# EAGLE design base (EAGLE 9.1.3)
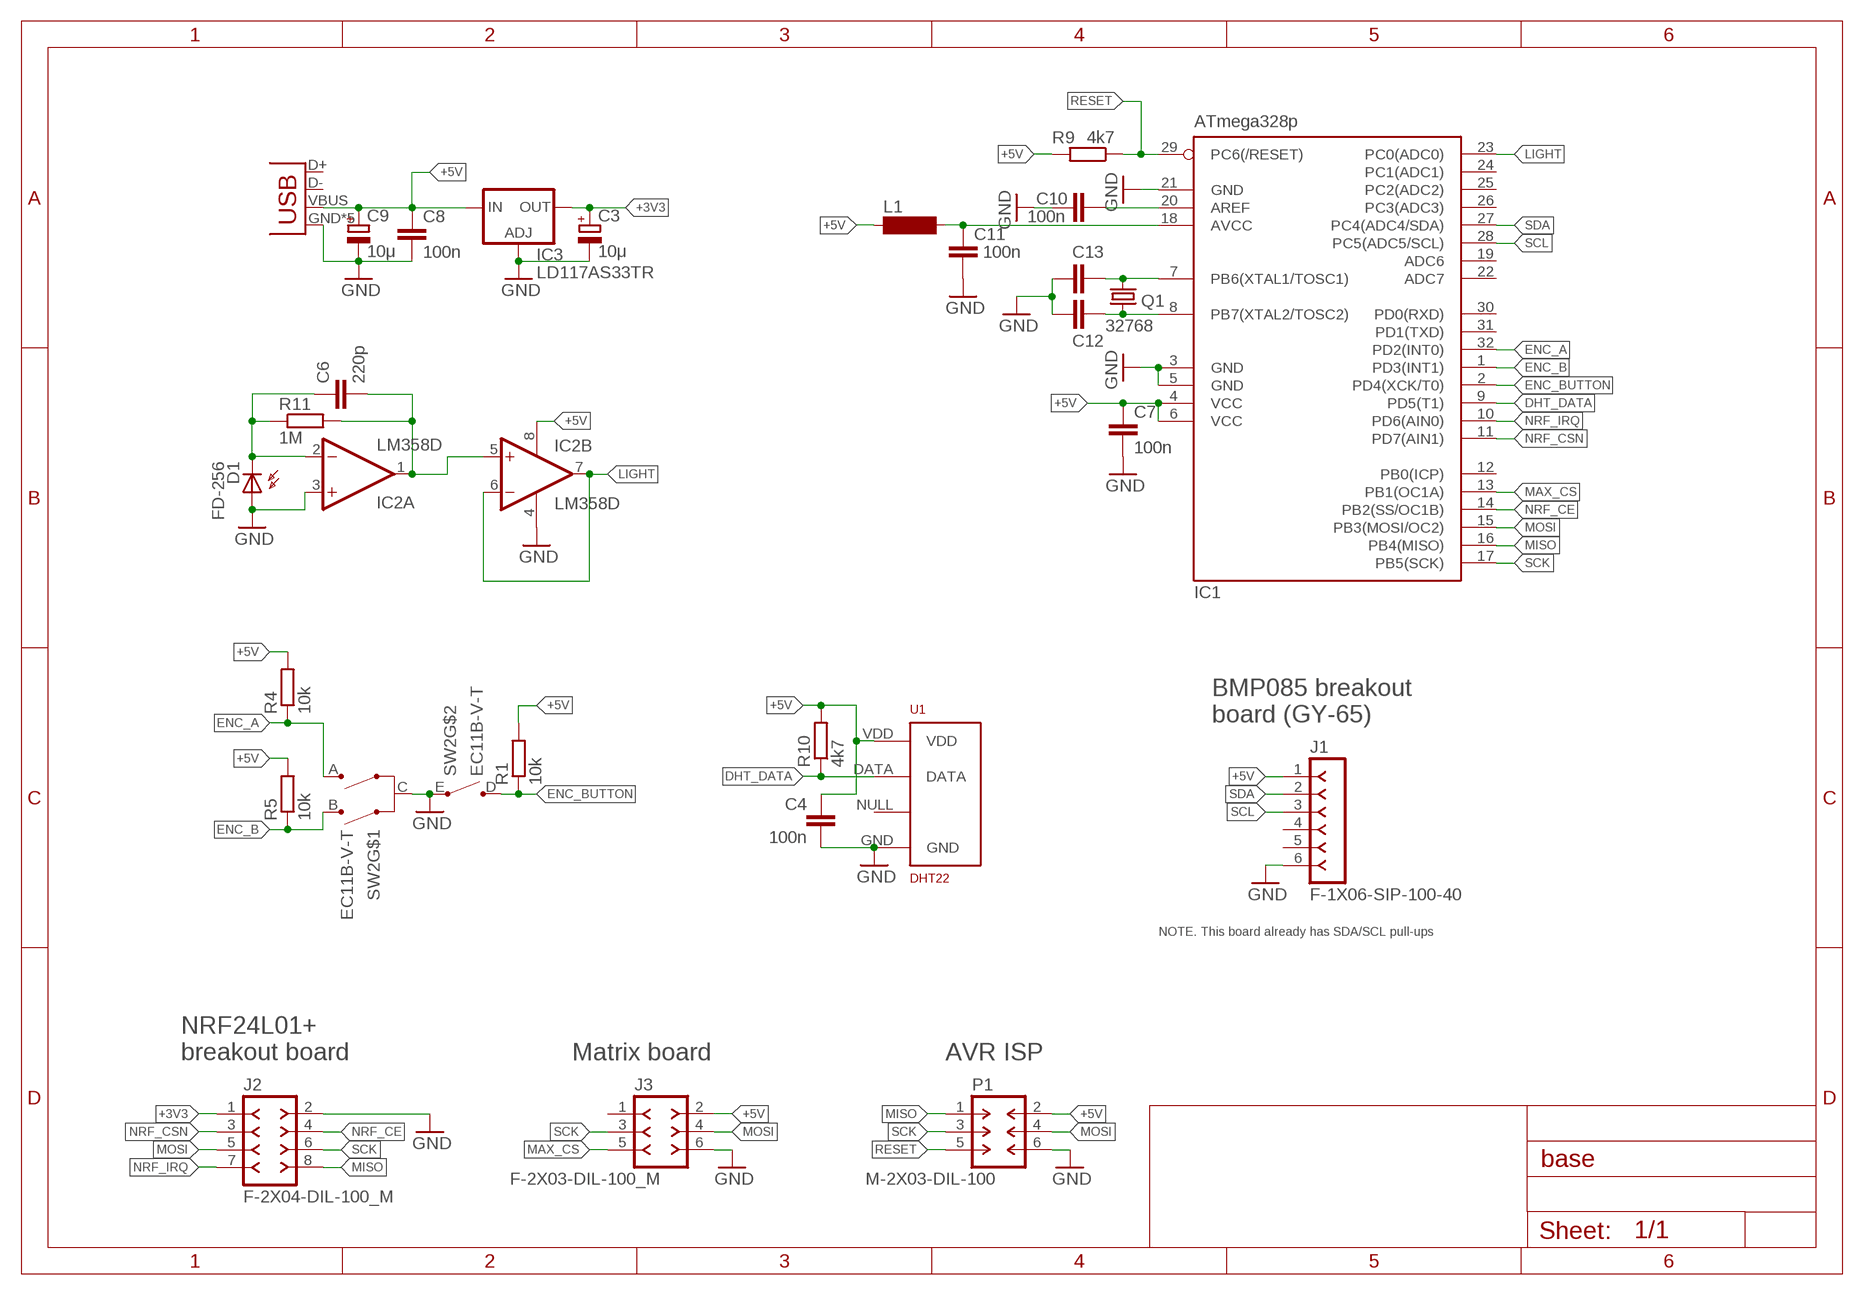
[diagram p0: schematic, sheet 1]

## Parts
C3  10μ  CPOL-EUD/7343-31R  [D/7343-31R]
C4  100n  C-EUC1206  [C1206]
C6  220p  C-EUC1206  [C1206]
C7  100n  C-EUC0805  [C0805]
C8  100n  C-EUC1206  [C1206]
C9  10μ  CPOL-EUD/7343-31R  [D/7343-31R]
C10  100n  C-EUC0805  [C0805]
C11  100n  C-EUC0805  [C0805]
C12  C-EUC0805  [C0805]
C13  C-EUC0805  [C0805]
D1  FD-256  BPX65  [BPX65]
IC1  ATmega328p  MEGA8-AI  [TQFP32-08]
IC2  LM358D  [SO08]
IC3  LD117AS33TR  [SOT223]
J1  F-1X06-SIP-100-40  [SIP-100-06-40]
J2  F-2X04-DIL-100_M  [DIL-100-2X04_M]
J3  F-2X03-DIL-100_M  [DIL-100-2X03_M]
JP5  USB-MICROB  [USB-MICROB]
L1  SM-1206  [SM-1206]
P1  M-2X03-DIL-100  [DIL-100-2X03]
Q1  32768  CRYSTALTC26H  [TC26H]
R1  10k  R-EU_R1206  [R1206]
R4  10k  R-EU_R1206  [R1206]
R5  10k  R-EU_R1206  [R1206]
R9  4k7  R-EU_R1206  [R1206]
R10  4k7  R-EU_R1206  [R1206]
R11  1M  R-EU_R1206  [R1206]
SW2  EC11B-V-T  [EC11B-V]
U1  DHT22  RHT03_DHT-22_AM2302RA  [RHT03_DHT-22/RA]

## Nets
+3V3: C3.+ IC3.4(OUT) J2.1
+5V: C4.1 C7.1 C8.1 C9.+ IC1.4(VCC) IC1.6(VCC) IC2.8(P:V+) IC3.3(IN) J1.1 J3.2 JP5.VBUS L1.1 P1.2 R1.2 R4.2 R5.2 R9.2 R10.2 U1.VDD
DHT_DATA: IC1.9(PD5(T1)) R10.1 U1.DATA
ENC_A: IC1.32(PD2(INT0)) R4.1 SW2.A
ENC_B: IC1.1(PD3(INT1)) R5.1 SW2.B
ENC_BUTTON: IC1.2(PD4(XCK/T0)) R1.1 SW2.D
GND: C3.- C4.2 C7.2 C8.2 C9.- C10.2 C11.2 C12.2 C13.2 D1.A IC1.3(GND) IC1.5(GND) IC1.21(GND) IC2.3(A:+IN) IC2.4(P:V-) IC3.1(ADJ) J1.6 J2.2 J3.6 JP5.GND JP5.MT1(GND) JP5.MT2(GND) JP5.P$1(GND) JP5.P$2(GND) P1.6 SW2.C SW2.E U1.GND
LIGHT: C6.2 IC1.23(PC0(ADC0)) IC2.1(A:OUT) IC2.5(B:+IN) IC2.6(B:-IN) IC2.7(B:OUT) R11.2
MAX_CS: IC1.13(PB1(OC1A)) J3.5
MISO: IC1.16(PB4(MISO)) J2.8 P1.1
MOSI: IC1.15(PB3(MOSI/OC2)) J2.5 J3.4 P1.4
N$33: C10.1 IC1.20(AREF)
N$34: C6.1 D1.K(C) IC2.2(A:-IN) R11.1
N$35: C11.1 IC1.18(AVCC) L1.2
N$36: C12.1 IC1.8(PB7(XTAL2/TOSC2)) Q1.1
N$37: C13.1 IC1.7(PB6(XTAL1/TOSC1)) Q1.2
NRF_CE: IC1.14(PB2(SS/OC1B)) J2.4
NRF_CSN: IC1.11(PD7(AIN1)) J2.3
NRF_IRQ: IC1.10(PD6(AIN0)) J2.7
RESET: IC1.29(PC6(/RESET)) P1.5 R9.1
SCK: IC1.17(PB5(SCK)) J2.6 J3.3 P1.3
SCL: IC1.28(PC5(ADC5/SCL)) J1.3
SDA: IC1.27(PC4(ADC4/SDA)) J1.2
Unconnected: IC1.12(PB0(ICP)) IC1.19(ADC6) IC1.22(ADC7) IC1.24(PC1(ADC1)) IC1.25(PC2(ADC2)) IC1.26(PC3(ADC3)) IC1.30(PD0(RXD)) IC1.31(PD1(TXD)) J1.4 J1.5 J3.1 JP5.D+ JP5.D- U1.NULL

## Notes on the sheet
- BMP085 breakout
  board (GY-65)
- NOTE. This board already has SDA/SCL pull-ups
- NRF24L01+
  breakout board
- Matrix board | AVR ISP

## Library data of the parts
C3 C9 = rcl:CPOL-EU: POLARIZED CAPACITOR, European symbol
C4 C6-C8 C10-C13 = rcl:C-EU: CAPACITOR, European symbol
D1 = opto-trans-siemens:BPX65: PHOTO DIODE; MPN: BPX65.; OC_FARNELL: 327451; OC_NEWARK: 06WX2764
IC1 = atmel:MEGA8: MICROCONTROLLER 8 Kbytes FLASH, 1 kbytes SRAM, 512 bytes EEPROM, USART, 6-channel 10 bit ADC, 2-channel 8 bit ADC Pin compatible with Atmega48, ATMega88, ATMega168 Source: avr.lbr; MPN: ATMEGA8-16AU; OC_FARNELL: 9171371; OC_NEWARK: 73M8863
IC2 = linear:LM358: OP AMP also LM158; LM258; LM2904 Source: http://cache.national.com/ds/LM/LM158.pdf
IC3 = v-reg:LD117A?*: Low drop fixed and adjustable positive voltage regulators 1 A Source: http://www.st.com/stonline/products/literature/ds/7194/ld1117axx.pdf
J1 = con-headers-jp:F-1X06-: FEMALE HEADER
J2 = con-headers-jp:F-2X04-: FEMALE HEADER
J3 = con-headers-jp:F-2X03-: FEMALE HEADER
JP5 = SparkFun-Connectors:USB: USB Connectors USB-B-PTH is fully proven SKU : PRT-00139/CONN-08278 USB-miniB is fully proven SKU : PRT-00587 USB-A-PCB is untested. USB-A-H is throughly reviewed, but untested. Spark Fun Electronics SKU : PRT-00437 USB-B-SMT is throughly reviewed, but untested. Needs silkscreen touching up. USB-A-S has not been used/tested USB-MB-H has not been used/tested USB-MICROB has been used. CONN-09505; PROD_ID: CONN-09505
L1 = inductor-neosid:SM-1206: INDUCTOR SMD chip inductor; OC_FARNELL: unknown; OC_NEWARK: unknown
P1 = con-headers-jp:M-2X03-: MALE HEADER
Q1 = crystal:CRYSTAL: CRYSTAL; OC_FARNELL: unknown; OC_NEWARK: unknown
R1 R4 R5 R9-R11 = rcl:R-EU_: RESISTOR, European symbol
SW2 = alps:EC11B-V-T: ALPS EC11B Vertikal mit Taster Drehimpulsgeber 11mm
U1 = RHT03_DHT-22_AM2302:RHT03_DHT-22_AM2302: RHT03 / DHT-22 / AM2302 Packages and symbol for the RHT03 / DHT-22 relative humidity and temperature sensor. Note: The AM2302 is a wired version of the DHT-22 which typically requires less clearance and is thus provided as a separate package.; PROD_ID: SEN-10167

## Board
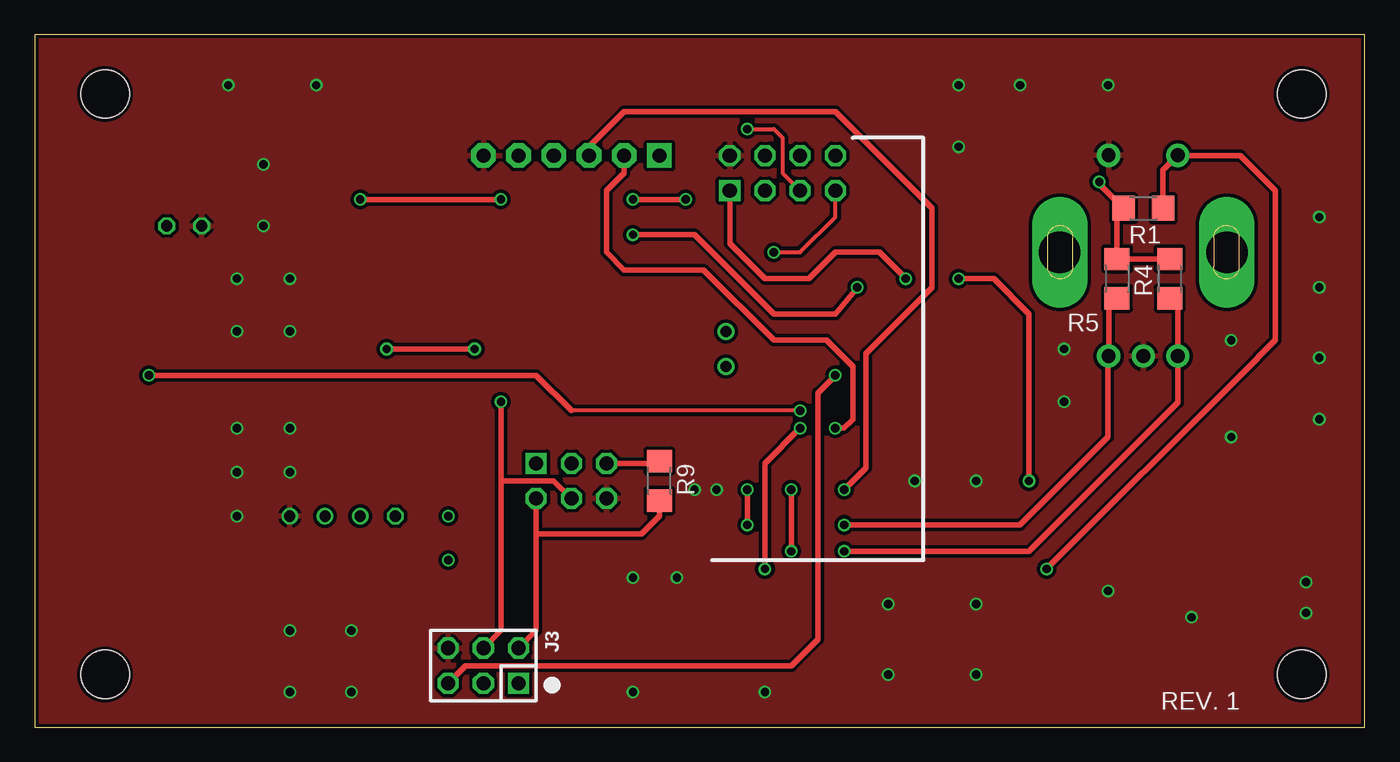
[diagram p1: board, top side]
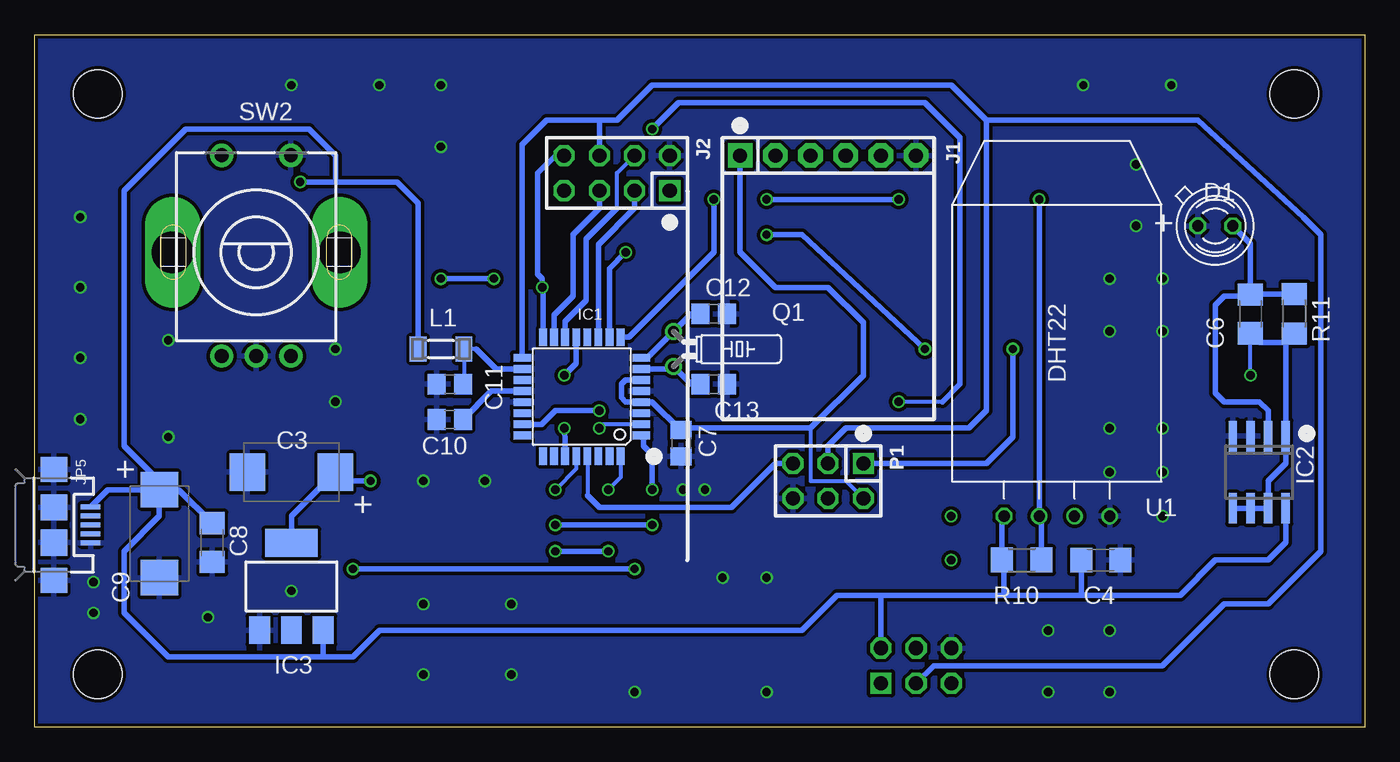
[diagram p2: board, bottom side, seen from below]

Size 96 x 50 mm. Coordinates in mm from the lower left corner, seen from the top.
Outline: 0,0 96,0 96,50 0,50 0,0
Copper layers (1*16): Top 0.035mm / dielectric 0.2mm / Bottom 0.035mm
Design rules "seeedstudio *": minimum track width 6mil, minimum drill 12mil, track to track 6mil, track to pad 6mil, pad to pad 6mil, via to via 6mil, smd to smd 0mil, copper to edge 10mil, drill to drill 10mil, minimum pad ring 6mil, minimum via ring 6mil, stop-mask expansion 2mil, vias tented up to drill 25mil, thermal gap 10mil
Holes 3.5 mm at 5.08,3.81 5.08,45.72 91.44,45.72 91.44,3.81

### Footprints (pad centres in the part's own frame; a part is rotated, then mirrored left to right if it is on the bottom)
D/7343-31R = smd 2.55 x 2.7: + 3.175,0; - -3.175,0
C1206 = smd 1.6 x 1.8: 1 -1.4,0; 2 1.4,0
C0805 = smd 1.3 x 1.5: 1 -0.95,0; 2 0.95,0
BPX65 = drill 0.813 octagon: A -0.889,-0.889; K 0.889,0.889
TQFP32-08 = smd 1.27 x 0.559: 1 -4.293,2.8; 2 -4.293,2; 3 -4.293,1.2; 4 -4.293,0.4; 5 -4.293,-0.4; 6 -4.293,-1.2; 7 -4.293,-2; 8 -4.293,-2.8; 17 4.293,-2.8; 18 4.293,-2; 19 4.293,-1.2; 20 4.293,-0.4; 21 4.293,0.4; 22 4.293,1.2; 23 4.293,2; 24 4.293,2.8 | smd 0.559 x 1.27: 9 -2.8,-4.293; 10 -2,-4.293; 11 -1.2,-4.293; 12 -0.4,-4.293; 13 0.4,-4.293; 14 1.2,-4.293; 15 2,-4.293; 16 2.8,-4.293; 25 2.8,4.293; 26 2,4.293; 27 1.2,4.293; 28 0.4,4.293; 29 -0.4,4.293; 30 -1.2,4.293; 31 -2,4.293; 32 -2.8,4.293
SO08 = smd 0.6 x 2.2: 1 -1.905,-2.6; 2 -0.635,-2.6; 3 0.635,-2.6; 4 1.905,-2.6; 5 1.905,2.6; 6 0.635,2.6; 7 -0.635,2.6; 8 -1.905,2.6
SOT223 = smd 1.5 x 2: 1 -2.3,-3.15; 2 0,-3.15; 3 2.3,-3.15 | smd 3.8 x 2: 4 0,3.15
SIP-100-06-40 = drill 1.016 pad 1.778 square: 1 -6.35,0 | drill 1.016 pad 1.778 octagon: 2 -3.81,0; 3 -1.27,0; 4 1.27,0; 5 3.81,0; 6 6.35,0
DIL-100-2X04_M = drill 1.016 square: 1 -3.81,1.27 | drill 1.016 octagon: 2 -3.81,-1.27; 3 -1.27,1.27; 4 -1.27,-1.27; 5 1.27,1.27; 6 1.27,-1.27; 7 3.81,1.27; 8 3.81,-1.27
DIL-100-2X03_M = drill 1.016 square: 1 -2.54,1.27 | drill 1.016 octagon: 2 -2.54,-1.27; 3 0,1.27; 4 0,-1.27; 5 2.54,1.27; 6 2.54,-1.27
USB-MICROB = smd 0.35 x 1.4: D+ 0,2.65; D- -0.65,2.65; GND 1.3,2.65; ID 0.65,2.65; VBUS -1.3,2.65 | smd 1.8 x 1.9: MT1 -4,0; MT2 4,0 | smd 1.9 x 1.9: P$1 -1.27,0; P$2 1.27,0
SM-1206 = smd 1.2 x 1.8: 1 -1.65,0; 2 1.65,0
DIL-100-2X03 = drill 1.016 square: 1 -2.54,-1.27 | drill 1.016 octagon: 2 -2.54,1.27; 3 0,-1.27; 4 0,1.27; 5 2.54,-1.27; 6 2.54,1.27
TC26H = drill 0.813: 1 -1.27,0; 2 1.27,0
R1206 = smd 1.6 x 1.803: 1 -1.422,0; 2 1.422,0
EC11B-V = drill 1 pad 1.676: A -2.5,-7.5; B 2.5,-7.5; C 0,-7.5; D -2.5,7; E 2.5,7 | drill 3 pad 3.3 long: G1 -6.032,0; G2 6.032,0
RHT03_DHT-22/RA = drill 0.8: DATA -1.27,0; GND 3.81,0; NULL 1.27,0 | drill 0.8 octagon: VDD -3.81,0

### Placement (x,y rotation side)
C3  77.47,18.41 0 bottom
C4  19.05,12.06 0 bottom
C6  8.26,29.84 270 bottom
C7  49.34,20.51 270 bottom
C8  83.19,13.34 270 bottom
C9  87,13.97 90 bottom
C10  66.04,22.23 180 bottom
C11  66.04,24.77 180 bottom
C12  46.99,29.84 0 bottom
C13  46.99,24.77 0 bottom
D1  10.79,36.2 315 bottom
IC1  56.52,23.87 180 bottom
IC2  7.62,18.41 180 bottom
IC3  77.47,10.16 0 bottom
J1  38.73,41.27 0 bottom
J2  53.98,40.01 180 bottom
J3  32.38,4.45 180 top
JP5  94.61,14.61 270 bottom
L1  66.67,27.3 0 bottom
P1  38.73,17.78 180 bottom
Q1  49.9,27.31 270 bottom
R1  80.01,37.47 180 top
R4  81.92,32.38 90 top
R5  78.11,32.38 90 top
R9  45.09,17.78 270 top
R10  24.77,12.06 180 bottom
R11  5.08,29.84 270 bottom
SW2  80.01,34.29 0 bottom
U1  22.23,15.24 0 bottom

### Tracks (layer width: path | path; a pad name or v marks a point on that pad's centre or on a via)
+3V3  (via drill 0.6)
  Top 0.406: v66.67,32.38 69.22,32.38 71.75,29.84 v71.75,17.78 | J2.1 50.16,34.92 52.7,32.38 55.88,32.38 57.78,34.29 60.96,34.29 v62.87,32.38
  Bottom 0.406: v62.87,32.38 v66.67,32.38 | v71.75,17.78 74.3,17.78 C3.+ 77.47,15.24 IC3.4
+5V  (via drill 0.6)
  Top 0.406: R4.2 R5.2 78.11,36.98 R1.2 76.83,39.22 v76.83,39.37 | J3.2 36.2,6.99 36.2,13.97 | 36.2,13.97 P1.2 | R9.2 45.09,15.24 43.81,13.97 36.2,13.97
  Bottom 0.305: 52.19,23.5 IC1.4 | 49.21,21.59 C7.1 | 40.01,21.59 40.01,17.78 37.47,17.78 P1.2
  Bottom 0.406: C9.+ 90.72,17.14 JP5.VBUS | C9.+ 86.36,17.14 | C8.1 85.59,17.14 86.36,17.14 | U1.VDD 26.19,15.09 R10.2 26.04,11.91 26.04,9.53 | IC2.8 5.71,13.34 6.99,12.06 10.79,12.06 13.34,9.53 20.32,9.53 | C4.1 20.45,9.65 20.32,9.53 | 52.19,23.5 51.44,23.5 49.4,21.46 C7.1 | 34.92,9.53 38.1,9.53 40.64,6.99 71.12,6.99 73.03,5.08 75.25,5.08 | 34.92,9.53 26.04,9.53 | 26.04,9.53 20.32,9.53 | L1.1 68.33,37.84 69.85,39.37 73.03,39.37 74.3,39.37 | 74.3,39.37 v76.83,39.37 | C9.+ 87,15.24 89.53,12.7 89.53,8.26 86.36,5.08 75.56,5.08 75.25,5.08 | 86.36,17.14 89.53,20.32 89.53,26.67 89.53,38.73 85.09,43.18 76.2,43.18 74.3,41.27 74.3,39.37 | J1.1 45.09,34.29 42.55,31.75 38.73,31.75 36.2,29.21 36.2,25.4 40.01,21.59 49.21,21.59 | J3.2 34.92,9.53 | IC3.3 75.17,5.16 75.25,5.08 | IC1.4 52.25,23.5 53.34,23.5 53.66,23.81 53.66,24.77 53.36,25.07 IC1.6
DHT_DATA  (via drill 0.6)
  Top 0.406: v46.99,38.1 v43.18,38.1 | v33.66,38.1 v23.5,38.1
  Bottom 0.406: R10.1 23.34,15.09 U1.DATA v23.5,38.1 | v43.18,38.1 v33.66,38.1 | IC1.9 53.12,28.16 46.99,34.29 v46.99,38.1
ENC_A  (via drill 0.6)
  Top 0.406: v54.61,17.14 v54.61,12.7 | v58.42,12.7 71.75,12.7 82.51,23.45 SW2.A 82.51,30.37 R4.1
  Bottom 0.305: IC1.32 53.72,18.04 v54.61,17.14
  Bottom 0.406: v54.61,12.7 v58.42,12.7
ENC_B  (via drill 0.6)
  Top 0.406: v58.42,14.61 64.77,14.61 71.12,14.61 77.47,20.95 77.47,26.75 SW2.B 77.51,30.37 R5.1 | v51.44,14.61 v51.44,17.14
  Bottom 0.406: v58.42,14.61 v51.44,14.61 | v51.44,17.14 51.44,19.68 52.07,20.32 52.07,20.91 IC1.1
ENC_BUTTON  (via drill 0.6)
  Top 0.406: R1.1 81.43,40.21 SW2.D 82.53,41.27 87,41.27 89.53,38.73 89.53,27.94 87,25.4 v73.03,11.43 | v55.24,21.59 52.7,19.05 v52.7,11.43
  Bottom 0.305: IC1.2 54.97,21.87 v55.24,21.59
  Bottom 0.406: v52.7,11.43 v73.03,11.43
GND  (via drill 0.6)
  other vias: 13.97,46.35 20.32,46.35 16.51,40.64 16.51,36.2 14.61,32.38 18.41,32.38 18.41,28.57 14.61,28.57 14.61,21.59 14.61,18.41 14.61,15.24 18.41,18.41 18.41,21.59 18.41,6.99 22.86,6.99 22.86,2.54 18.41,2.54 43.18,2.54 43.18,10.79 46.35,10.79 52.7,2.54 61.59,3.81 61.59,8.89 67.94,3.81 67.94,8.89 63.5,17.78 67.94,17.78 66.67,41.91 66.67,46.35 71.12,46.35 77.47,46.35 92.71,36.83 92.71,31.75 92.71,26.67 92.71,22.23 91.76,10.48 91.76,8.26 83.5,7.94 77.47,9.84 74.3,23.5 74.3,27.3 86.36,27.94 86.36,20.95 49.21,17.14 47.62,17.14
  pour Top (isolate 0.254): 0,50.16 95.89,50.16 95.89,0 0,0
  pour Bottom (isolate 0.254): 0,50.16 95.89,50.16 95.89,0 0,0
LIGHT  (via drill 0.6)
  Top 0.305: v55.24,22.86 38.73,22.86
  Top 0.406: 38.73,22.86 36.2,25.4 v8.26,25.4
  Bottom 0.305: v8.26,25.4 C6.2
  Bottom 0.406: 5.71,27.79 IC2.1 5.71,19.05 6.99,17.78 IC2.7 IC2.6 IC2.5 | 5.71,27.79 R11.2 | 5.71,27.79 7.6,27.79 C6.2 | IC1.23 59.41,21.87 58.42,22.86 v55.24,22.86
MAX_CS  (via drill 0.6)
  Top 0.406: v57.78,25.4 56.52,24.13 56.52,6.35 54.61,4.45 31.11,4.45 J3.5
  Bottom 0.406: IC1.13 56.91,26.27 v57.78,25.4
MISO  (via drill 0.6)
  Top 0.406: v59.37,31.75 57.78,29.84 53.34,29.84 47.62,35.56 v43.18,35.56 | v31.75,27.3 v25.4,27.3
  Bottom 0.305: 59.31,31.69 v59.37,31.75
  Bottom 0.406: v43.18,35.56 40.64,35.56 v31.75,27.3 | v25.4,27.3 25.4,20.95 27.3,19.05 P1.1 | IC1.16 59.31,31.69 | v59.37,31.75 59.37,32.38 59.69,32.7 59.69,40.01 58.42,41.27 J2.8
MOSI  (via drill 0.6)
  Top 0.305: v51.44,43.18 53.34,43.18 53.98,42.55 53.98,40.01 J2.5
  Top 0.406: v33.66,23.5 33.66,17.78 | J3.4 33.66,6.99 33.66,17.78 | 33.66,17.78 37.47,17.78 P1.4
  Bottom 0.305: 30.48,23.5 v33.66,23.5
  Bottom 0.406: v51.44,43.18 49.53,45.09 31.75,45.09 29.21,42.55 29.21,24.77 30.48,23.5 | IC1.15 58.52,29.75 57.15,31.11 57.15,35.56 55.24,37.47 J2.5
N$15  (via drill 0.6)
  other vias: 29.84,15.24
N$16  (via drill 0.6)
  other vias: 29.84,12.06
N$33
  Bottom 0.406: IC1.20 63.05,24.27 C10.1
N$34
  Bottom 0.406: R11.1 8.23,31.27 C6.1 | C6.1 8.26,34.91 D1.K | IC2.2 6.99,22.86 7.62,23.5 10.16,23.5 10.79,24.13 10.79,30.48 10.16,31.11 8.38,31.11 C6.1 | D1.K
N$35
  Bottom 0.305: C11.1 65.03,24.83 L1.2 64.14,27.3
  Bottom 0.406: IC1.18 62.7,25.87 64.14,27.3
N$36
  Bottom 0.406: IC1.8 51.81,26.67 Q1.1 48.63,29.84 C12.1
N$37
  Bottom 0.406: IC1.7 50.07,25.87 Q1.2 48.63,24.77 C13.1
NRF_CE
  Bottom 0.305: 53.98,37.47 53.98,40.01 J2.4
  Bottom 0.406: IC1.14 57.72,29.28 56.2,30.8 56.2,35.24 53.98,37.47
NRF_CSN
  Bottom 0.406: IC1.11 55.31,34.85 52.7,37.47 J2.3
NRF_IRQ  (via drill 0.6)
  Top 0.305: v53.34,34.29 55.24,34.29 57.78,36.83 J2.7
  Bottom 0.406: IC1.10 54.52,33.12 v53.34,34.29
RESET
  Top 0.406: P1.5 44.93,19.05 R9.1
  Bottom 0.305: IC1.29 56.12,16.75
  Bottom 0.406: 56.12,16.75 55.24,15.88 45.72,15.88 42.55,19.05 P1.5
SCK
  Bottom 0.406: IC1.17 60.81,42.06 59.05,43.81 55.24,43.81 | P1.3 38.73,20.32 37.47,21.59 28.57,21.59 27.3,22.86 27.3,43.81 | 27.3,43.81 29.84,46.35 51.44,46.35 53.98,43.81 55.24,43.81 | 27.3,43.81 12.06,43.81 4.45,36.83 3.17,35.56 3.17,12.7 6.99,8.89 10.16,8.89 14.61,4.45 31.11,4.45 J3.3 | J2.6 55.24,43.81
SCL  (via drill 0.6)
  Top 0.406: J1.3 40.01,41.91 42.55,44.45 57.78,44.45 64.77,37.47 64.77,31.75 60.01,26.99 60.01,18.73 v58.42,17.14
  Bottom 0.305: IC1.28 56.91,18.65 v58.42,17.14
SDA  (via drill 0.6)
  Top 0.406: v57.78,21.59 58.42,21.59 59.05,22.23 59.05,26.04 57.15,27.94 53.34,27.94 48.26,33.02 42.55,33.02 41.27,34.29 41.27,38.73 42.55,40.01 J1.2
  Bottom 0.406: IC1.27 57.72,20.89 v57.78,21.59

### Text on the board
tNames: REV. 1
bNames: + | + | +